# Altium schematic sheet PAGE120.SchDoc
size 246 x 182 mm
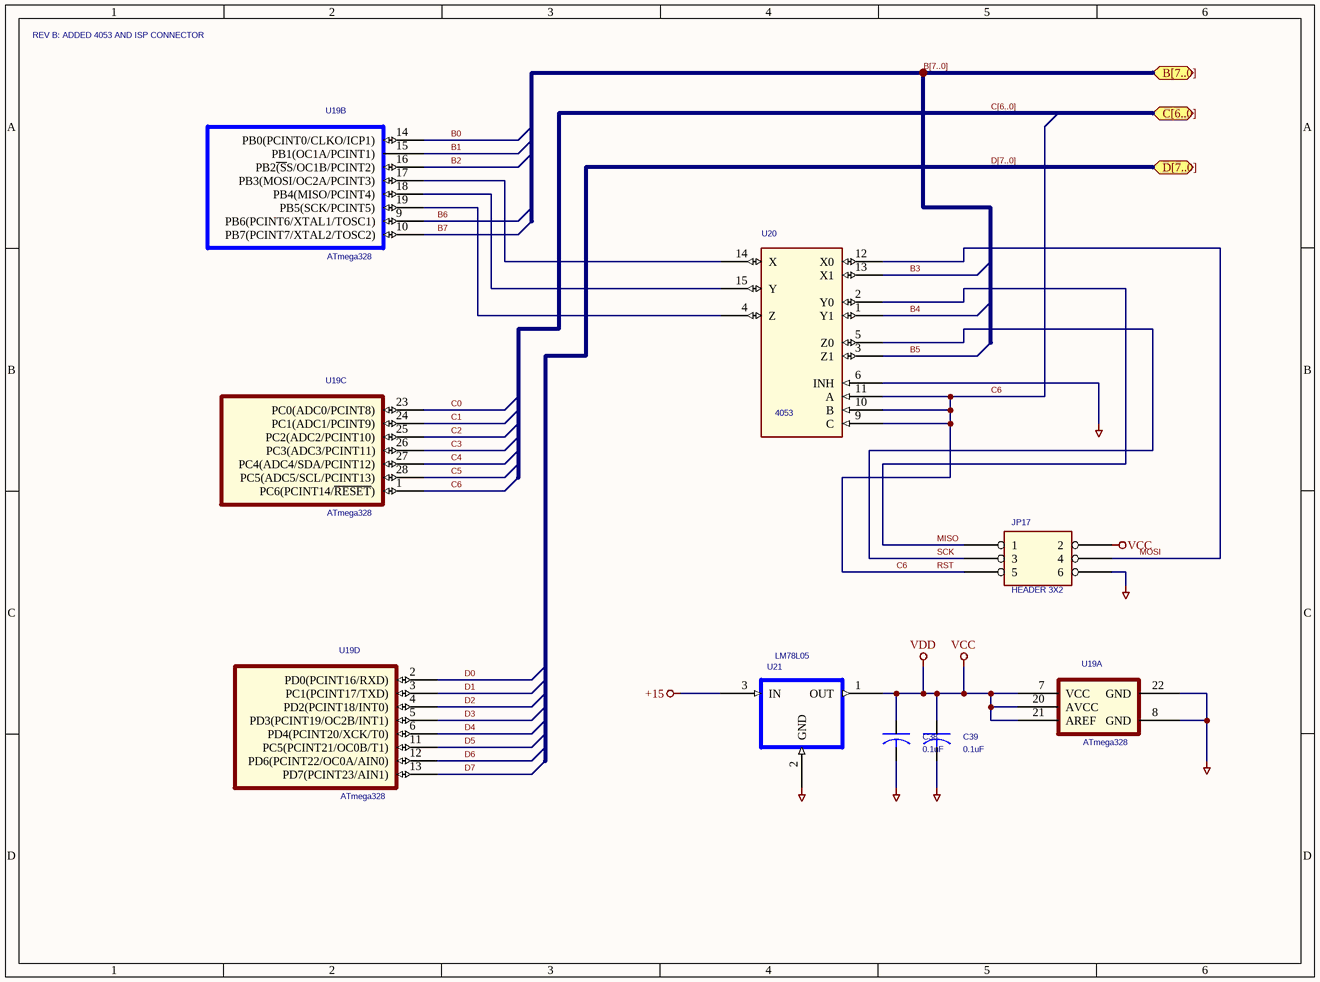
[diagram p0: PAGE120.SchDoc]

## Parts
C38  0.1uF  [AXIALCAP0.3]
C39  0.1uF  [AXIALCAP0.3]
JP17  HEADER 3X2  [JMPR6]
U19  ATmega328  [DIP28.3]  (parts A,B,C,D of 4)
U20  4053  [DIP16]
U21  LM78L05  [TO92-LM336]

## Ports
B[7..0] (bidir), C[6..0] (bidir), D[7..0] (bidir)

## Nets
+15: U21.3(IN)
AGND: C38.2 C39.2 JP17.6 U19.8(GND) U19.22(GND) U20.6(INH) U21.2(GND)
VCC: C38.1 C39.1 JP17.2 U19.7(VCC) U19.20(AVCC) U19.21(AREF) U20.16(VDD) U21.1(OUT)  [also labelled VDD]
VEE: U20.7(VEE)
VSS: U20.8(VSS)
B0: U19.14(PB0(PCINT0/CLKO/ICP1))
B1: U19.15(PB1(OC1A/PCINT1))
B2: U19.16(PB2~{(S}S/OC1B/PCINT2))
B3: U20.13(X1)
B4: U20.1(Y1)
B5: U20.3(Z1)
B6: U19.9(PB6(PCINT6/XTAL1/TOSC1))
B7: U19.10(PB7(PCINT7/XTAL2/TOSC2))
C0: U19.23(PC0(ADC0/PCINT8))
C1: U19.24(PC1(ADC1/PCINT9))
C2: U19.25(PC2(ADC2/PCINT10))
C3: U19.26(PC3(ADC3/PCINT11))
C4: U19.27(PC4(ADC4/SDA/PCINT12))
C5: U19.28(PC5(ADC5/SCL/PCINT13))
C6: JP17.5 U19.1(PC6(PCINT14/~{RESET})) U20.9(C) U20.10(B) U20.11(A)  [also labelled RST]
D0: U19.2(PD0(PCINT16/RXD))
D1: U19.3(PC1(PCINT17/TXD))
D2: U19.4(PD2(PCINT18/INT0))
D3: U19.5(PD3(PCINT19/OC2B/INT1))
D4: U19.6(PD4(PCINT20/XCK/T0))
D5: U19.11(PC5(PCINT21/OC0B/T1))
D6: U19.12(PD6(PCINT22/OC0A/AIN0))
D7: U19.13(PD7(PCINT23/AIN1))
MISO: JP17.1 U20.2(Y0)
MOSI: JP17.4 U20.12(X0)
SCK: JP17.3 U20.5(Z0)
NetU19_17: U19.17(PB3(MOSI/OC2A/PCINT3)) U20.14(X)
NetU19_18: U19.18(PB4(MISO/PCINT4)) U20.15(Y)
NetU19_19: U19.19(PB5(SCK/PCINT5)) U20.4(Z)

## Buses and harness runs
bus B[7..0] = port B[7..0]
bus C[6..0] = port C[6..0]
bus D[7..0] = port D[7..0]

## Notes on the sheet
- REV B: ADDED 4053 AND ISP CONNECTOR

## Library data of the parts
C38 C39 = CAP_Dup1
U21 = REG POS L
U19 = ATmega328: PACKAGE: ATMEGA